# Altium schematic sheet ESC.SchDoc: ESCs
size B; Date: 03/24/2022; Author: Nathan Ayer; Organization: ORGANIZATION; Address1: ADDRESS 1; Address2: ADDRESS 2; Address3: ADDRESS 3; Address4: ADDRESS 4; DocumentNumber: 1; Revision: -; SheetNumber: 1; SheetTotal: 3; ENG_APP_DATE: --/--/--; DSN_APP_DATE: --/--/--; CHK_APP_DATE: --/--/--
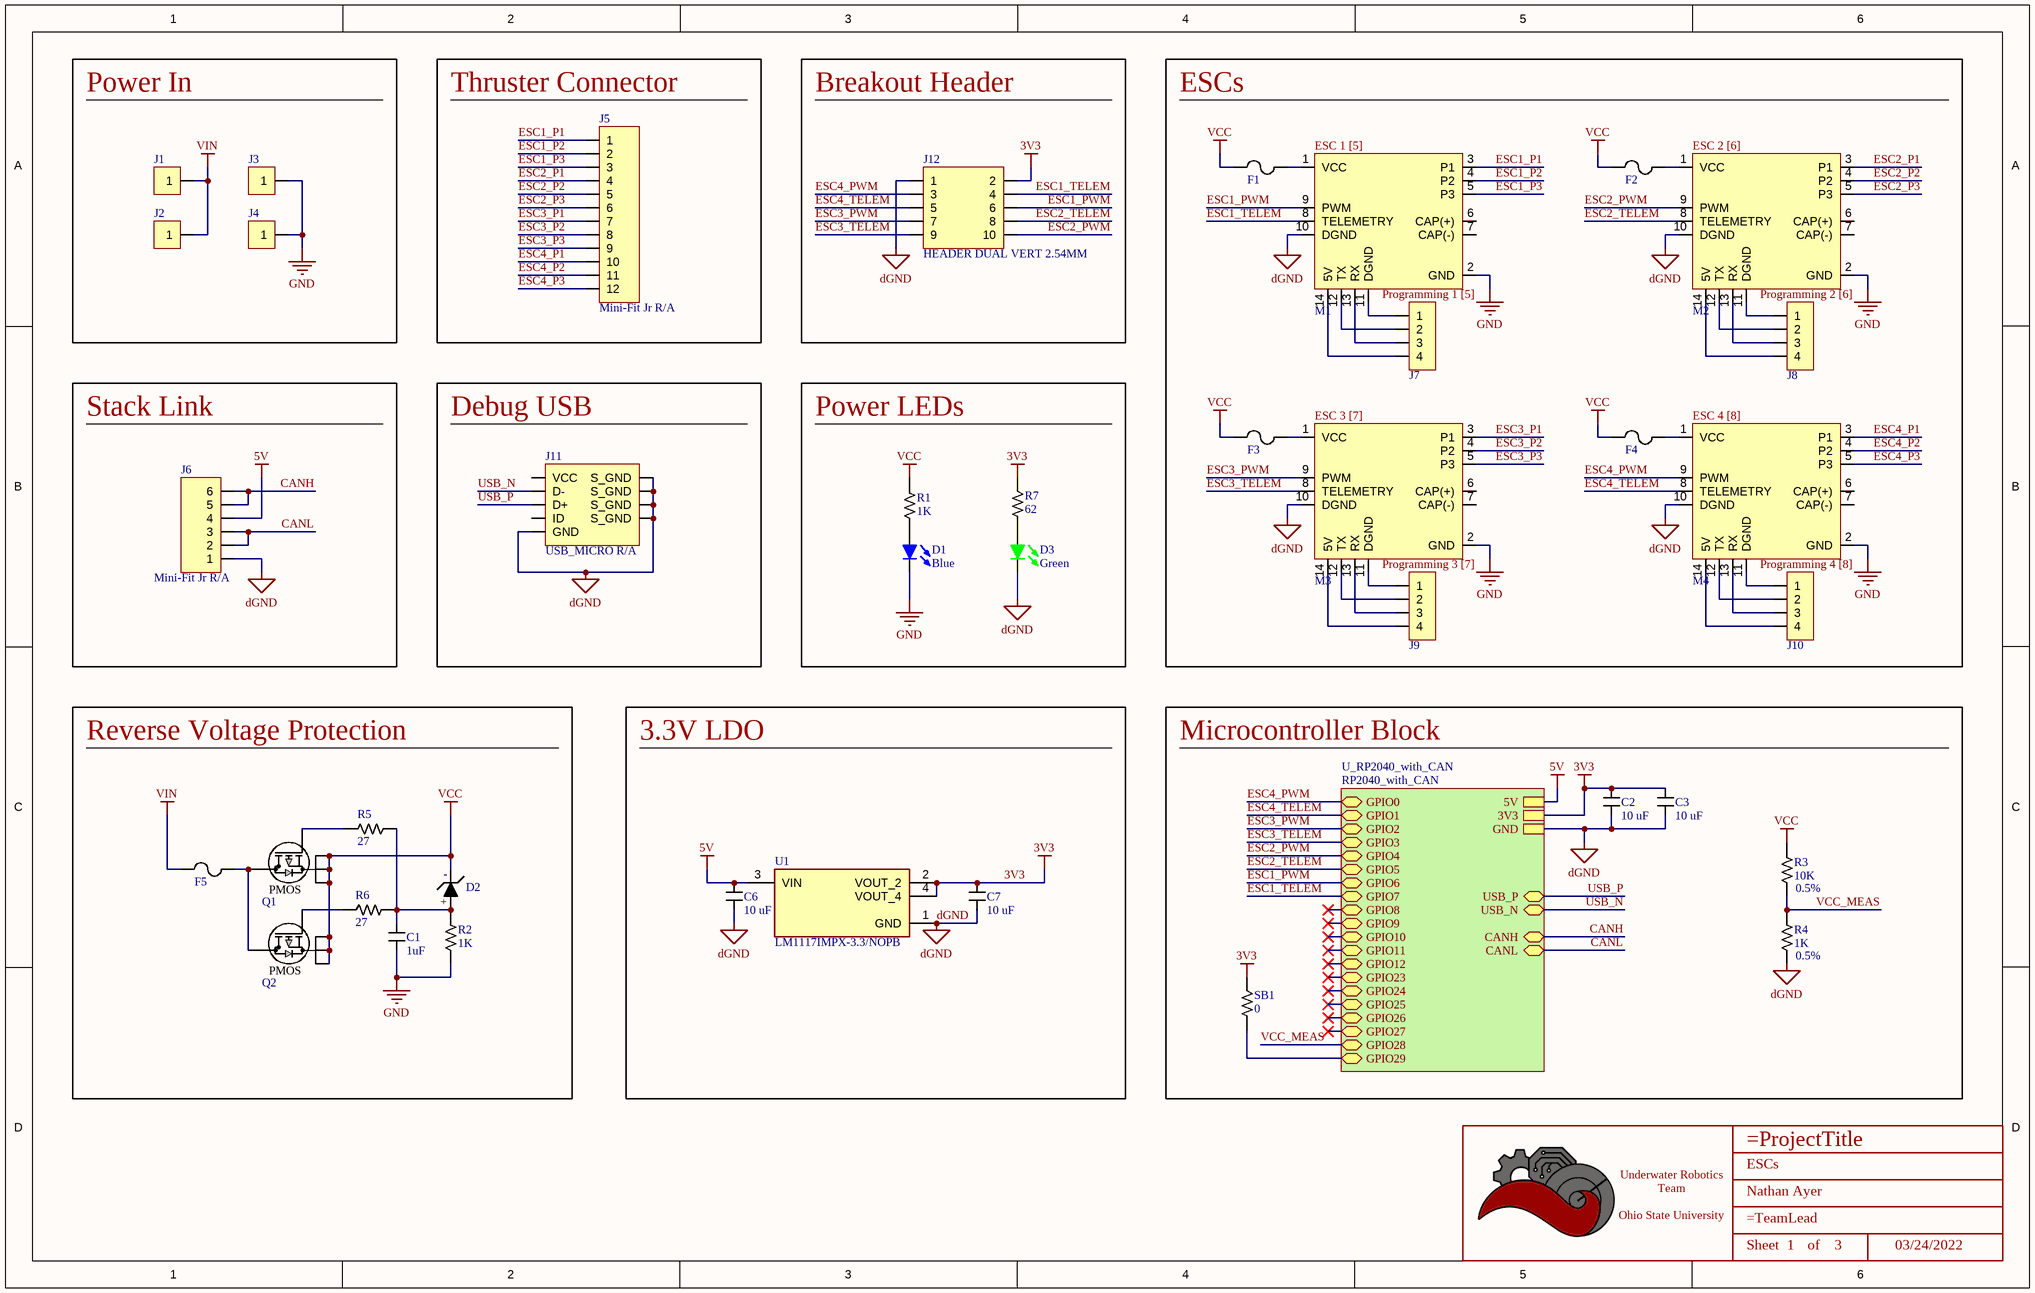
[diagram p0: ESC.SchDoc]

## Parts
*  Title_Block  [LOGO]  (value not drawn)  (graphical)
C1  value 1uF  [CAPACITOR_0603]  (hidden comment: 1uF Ceramic 16V)
C2  Value (uF): 10 uF  [CAPACITOR_0603]  (hidden comment: 10uF Ceramic 6.3V)
C3  Value (uF): 10 uF  [CAPACITOR_0603]  (hidden comment: 10uF Ceramic 6.3V)
C6  Value (uF): 10 uF  [CAPACITOR_0603]  (hidden comment: 10uF Ceramic 6.3V)
C7  Value (uF): 10 uF  [CAPACITOR_0603]  (hidden comment: 10uF Ceramic 6.3V)
D1  Color: Blue  [LED_0603]  (hidden comment: 150060BS75000)
D2  Zener_Diode_10V_410mW  [SOD-123]  (value not drawn)
D3  Color: Green  [LED_0603]  (hidden comment: 150060GS75000)
F1  0685H9150-01  [0501Series_LTF]  (value not drawn)
F2  0685H9150-01  [0501Series_LTF]  (value not drawn)
F3  0685H9150-01  [0501Series_LTF]  (value not drawn)
F4  0685H9150-01  [0501Series_LTF]  (value not drawn)
F5  1245HC60-RTR  [2-SMD Fuse]  (value not drawn)
J1  Redcube M4 Term 85A  [Redcube M4 Term 85A]  (value not drawn)
J2  Redcube M4 Term 85A  [Redcube M4 Term 85A]  (value not drawn)
J3  Redcube M4 Term 85A  [Redcube M4 Term 85A]  (value not drawn)
J4  Redcube M4 Term 85A  [Redcube M4 Term 85A]  (value not drawn)
J5  Mini-Fit Jr R/A  [CONN_MOLEX_MINIFIT JR_12 POS_R/A]
J6  Mini-Fit Jr R/A  [CONN_MOLEX_MINIFIT JR_6 POS_R/A]
J7  HEADER VERT 2.54MM  [HEADER_4PIN_2.54MM]  (value not drawn)
J8  HEADER VERT 2.54MM  [HEADER_4PIN_2.54MM]  (value not drawn)
J9  HEADER VERT 2.54MM  [HEADER_4PIN_2.54MM]  (value not drawn)
J10  HEADER VERT 2.54MM  [HEADER_4PIN_2.54MM]  (value not drawn)
J11  USB_MICRO R/A  [CONN_MINIUSB]
J12  HEADER DUAL VERT 2.54MM  [HEADER_2X5PIN_2.54MM]
M1  APD 80F3[X]  [APD 80F3[X]]  (value not drawn)
M2  APD 80F3[X]  [APD 80F3[X]]  (value not drawn)
M3  APD 80F3[X]  [APD 80F3[X]]  (value not drawn)
M4  APD 80F3[X]  [APD 80F3[X]]  (value not drawn)
Q1  MOSFET P-Ch 30V 60A SO-8  [MOSFET_7DP-T1-GE3_VIS]  (value not drawn)
Q2  MOSFET P-Ch 30V 60A SO-8  [MOSFET_7DP-T1-GE3_VIS]  (value not drawn)
R1  Value  (Ohms): 1K  [RESISTOR_0603]  (hidden comment: 1k Ohm 5% 1/8W)
R2  Value  (Ohms): 1K  [RESISTOR_0603]  (hidden comment: 1k Ohm 5% 1/8W)
R3  Value  (Ohms): 10K  [RESISTOR_0603]  (hidden comment: 10k Ohm 0.5% 1/10W)
R4  Value  (Ohms): 1K  [RESISTOR_0603]  (hidden comment: 1k Ohm 5% 1/10W)
R5  Value  (Ohms): 27  [RESISTOR_0603]  (hidden comment: 27 Ohm 5% 1/8W)
R6  Value  (Ohms): 27  [RESISTOR_0603]  (hidden comment: 27 Ohm 5% 1/8W)
R7  Value  (Ohms): 62  [RESISTOR_0603]  (hidden comment: 62 Ohm 1% 1/4W)
SB1  Value  (Ohms): 0  [RESISTOR_0603]  (hidden comment: 0 Ohm Jumper No Fit)
U1  LM1117IMPX-3.3/NOPB  [SOT-223-4]

## Blocks framed on the sheet
Power In: J1-J4
Thruster Connector: J5
Breakout Header: J12
ESCs: F1-F4 J7-J10 M1-M4
Stack Link: J6
Debug USB: J11
Power LEDs: D1 D3 R1 R7
Reverse Voltage Protection: C1 D2 F5 Q1 Q2 R2 R5 R6
3.3V LDO: C6 C7 U1
Microcontroller Block: C2 C3 R3 R4 SB1

## Sub-sheets
U_RP2040_with_CAN = RP2040_with_CAN: USB_P (bidir), USB_N (bidir), 5V, CANH (bidir), CANL (bidir), GPIO0 (bidir), GPIO1 (bidir), GPIO2 (bidir), GPIO3 (bidir), GPIO4 (bidir), GPIO5 (bidir), GPIO6 (bidir), GPIO7 (bidir), GPIO8 (bidir), GPIO9 (bidir), GPIO10 (bidir), GPIO11 (bidir), GPIO12 (bidir), GPIO23 (bidir), GPIO24 (bidir), GPIO25 (bidir), GPIO26 (bidir), GPIO27 (bidir), GPIO28 (bidir), GPIO29 (bidir), 3V3, GND

## Nets
3V3: C2.1 C3.1 C7.1 J12.2 R7.2 SB1.2 U1.2(VOUT_2) U1.4(VOUT_4) ; sheet U_RP2040_with_CAN/3V3
5V: C6.1 J6.4 U1.3(VIN) ; sheet U_RP2040_with_CAN/5V
dGND: C2.2 C3.2 C6.2 C7.2 D3.2 J6.1 J11.5(GND) J11.6(S_GND) J11.7(S_GND) J11.8(S_GND) J11.9(S_GND) J12.1 M1.10(DGND) M2.10(DGND) M3.10(DGND) M4.10(DGND) R4.2 U1.1(GND) ; sheet U_RP2040_with_CAN/GND
GND: C1.1 D1.2 J3.1 J4.1 M1.2(GND) M2.2(GND) M3.2(GND) M4.2(GND) R2.2
VCC: D2.2 F1.1 F2.1 F3.1 F4.1 Q1.1(S) Q1.2(S) Q1.3(S) Q2.1(S) Q2.2(S) Q2.3(S) R1.1 R3.1
VIN: F5.1 J1.1 J2.1
CANH: J6.5 J6.6 ; sheet U_RP2040_with_CAN/CANH
CANL: J6.2 J6.3 ; sheet U_RP2040_with_CAN/CANL
ESC1_P1: J5.1 M1.3(P1)
ESC1_P2: J5.2 M1.4(P2)
ESC1_P3: J5.3 M1.5(P3)
ESC1_PWM: J12.6 M1.9(PWM) ; sheet U_RP2040_with_CAN/GPIO6
ESC1_TELEM: J12.4 M1.8(TELEMETRY) ; sheet U_RP2040_with_CAN/GPIO7
ESC2_P1: J5.4 M2.3(P1)
ESC2_P2: J5.5 M2.4(P2)
ESC2_P3: J5.6 M2.5(P3)
ESC2_PWM: J12.10 M2.9(PWM) ; sheet U_RP2040_with_CAN/GPIO4
ESC2_TELEM: J12.8 M2.8(TELEMETRY) ; sheet U_RP2040_with_CAN/GPIO5
ESC3_P1: J5.7 M3.3(P1)
ESC3_P2: J5.8 M3.4(P2)
ESC3_P3: J5.9 M3.5(P3)
ESC3_PWM: J12.7 M3.9(PWM) ; sheet U_RP2040_with_CAN/GPIO2
ESC3_TELEM: J12.9 M3.8(TELEMETRY) ; sheet U_RP2040_with_CAN/GPIO3
ESC4_P1: J5.10 M4.3(P1)
ESC4_P2: J5.11 M4.4(P2)
ESC4_P3: J5.12 M4.5(P3)
ESC4_PWM: J12.3 M4.9(PWM) ; sheet U_RP2040_with_CAN/GPIO0
ESC4_TELEM: J12.5 M4.8(TELEMETRY) ; sheet U_RP2040_with_CAN/GPIO1
USB_N: J11.2(D-) ; sheet U_RP2040_with_CAN/USB_N
USB_P: J11.3(D+) ; sheet U_RP2040_with_CAN/USB_P
VCC_MEAS: R3.2 R4.1 ; sheet U_RP2040_with_CAN/GPIO28
NetC1_2: C1.2 D2.1 R2.1 R5.2 R6.1
NetD1_1: D1.1 R1.2
NetD3_1: D3.1 R7.1
NetF1_2: F1.2 M1.1(VCC)
NetF2_2: F2.2 M2.1(VCC)
NetF3_2: F3.2 M3.1(VCC)
NetF4_2: F4.2 M4.1(VCC)
NetF5_2: F5.2 Q1.D Q2.D
NetJ7_1: J7.1 M1.11(DGND)
NetJ7_2: J7.2 M1.12(TX)
NetJ7_3: J7.3 M1.13(RX)
NetJ7_4: J7.4 M1.14(5V)
NetJ8_1: J8.1 M2.11(DGND)
NetJ8_2: J8.2 M2.12(TX)
NetJ8_3: J8.3 M2.13(RX)
NetJ8_4: J8.4 M2.14(5V)
NetJ9_1: J9.1 M3.11(DGND)
NetJ9_2: J9.2 M3.12(TX)
NetJ9_3: J9.3 M3.13(RX)
NetJ9_4: J9.4 M3.14(5V)
NetJ10_1: J10.1 M4.11(DGND)
NetJ10_2: J10.2 M4.12(TX)
NetJ10_3: J10.3 M4.13(RX)
NetJ10_4: J10.4 M4.14(5V)
NetQ1_4: Q1.4(G) R5.1
NetQ2_4: Q2.4(G) R6.2
NetSB1_1: SB1.1 ; sheet U_RP2040_with_CAN/GPIO29

Not connected (* = marked no-connect by the designer): J11 1(VCC) 4(ID); M1 6(CAP(+)) 7(CAP(-)); M2 6(CAP(+)) 7(CAP(-)); M3 6(CAP(+)) 7(CAP(-)); M4 6(CAP(+)) 7(CAP(-))

## Notes on the sheet
- (near M1) ESC 1 [5]
- (near M2) ESC 2 [6]
- (near M1) Programming 1 [5]
- (near M2) Programming 2 [6]
- (near M3) ESC 3 [7]
- (near M4) ESC 4 [8]
- (near M3) Programming 3 [7]
- (near M4) Programming 4 [8]
- (near R3) 0.5%
- (near R4) 0.5%
- DWG. NO.
- REV.
- SHT.
- THIS DOCUMENT AND THE DATA DISCLOSED HEREIN OR HEREWITH IS THE PROPERTY OF ALTIUM LIMITED AND MAY BE FREELY DISTRIBUTED IN WHOLE. NO RIGHTS ARE RESERVED OR EXPRESS OR IMPLIED WARANTEE GIVEN.
- REVISION
- DESCRIPTION
- DATE
- APPROVED
- ENG:
- APPROVALS
- PROJECT
- DSN:
- CHK:
- REFERENCE DOCUMENTS
- PROJECT REVISION:
- TITLE
- DOCUMENT REVISION:
- DESIGN ITEM:
- BOM:
- FAB DWG:
- PCB DWG:
- ASSY DWG:
- SCALE:
- SIZE
- B
- CAGE CODE
- FILE NAME
- DWG NO.
- SHEET
- OF
- REV
- (in symbol SIR167DP-T1-GE3) PMOS
- (in symbol Title_Block) Underwater Robotics Team / Ohio State University; Sheet; of
- (in symbol Zener_Diode_10V_410mW) -; +

## Library data of the parts
* = Title_Block: UWRT Schematic Title Block Template / Created June 2021, Dylan Trainor
C1 = CAPACITOR_1uF_0603: Cap 1uF 16V +/-10% / Ceramic 0603; Made By: Flip B; Tolerance: +/- 10%; Voltage: 16V; Supplier 1: Digi-Key; Supplier Part Number 1: 399-7847-1-ND
C2 C3 C6 C7 = CAPACITOR_10uF_0603: Cap 10uF 6.3V +/-20% / Ceramic 0603; Made By: Flip B; ComponentLink1Description: Digikey; ComponentLink1URL: https://www.digikey.com/en/products/detail/samsung-electro-mechanics/CL10A106MQ8NNNC/3886777; Supplier 1: Digi-Key; Supplier Part Number 1: 1276-1119-1-ND; Tolerance: +/- 20%; Voltage: 6.3V
D1 = LED_Blue_0603: LED Blue Vf= 3.2V If = 0.020A / 150060BS75000; Made By: Robert Pafford; Forward Current: 20mA; Forward Voltage: 3.2V; Package: 0603; Supplier 1: Digi-Key; Supplier Part Number 1: 732-4966-1-ND
D2 = Zener_Diode_10V_410mW: Zener Diode | 10 V | 410 mW | SOD 123; Made By: Nathan A; Voltage - Zener: 10V; Power: 410mW; Package: SOD-123; Supplier 1: Digi-Key; Supplier Part Number 1: 3757-BZT52-C10_R1_00001CT-ND; ComponentLink1Description: Datasheet; ComponentLink1URL: https://www.panjit.com.tw/upload/datasheet/BZT52-C2V4_SERIES.pdf
D3 = LED_Green_0603_3.2V: LED Green Vf= 3.2V If = 0.025A / 150060GS75000; Made By: Flip B; Forward Current: 25mA; Supplier 1: Digi-Key; ComponentLink1Description: Datasheet; ComponentLink1URL: https://www.we-online.de/katalog/datasheet/150060GS75000.pdf; Supplier Part Number 1: 732-4971-1-ND; Forward Voltage: 3.2V; Package: 0603
F1-F4 = Bel Fuse 15A: Bel Fuse  | 15A | 32V DC | SMD | Fast Blow | 1206; Current Rating: 15; Breaking Capacity: 150A; Mfr_Name: Bel Fuse; Manufacturer_Part_Number: 0685H9150-01; Voltage Rating: 32V; Response Time: Fast Blow; Package: 1206; Created By: Nathan Ayer
F5 = Eaton 60A Fuse: Eaton  | 60A | 80V DC | SMD | Fast Blow | 2-SMD; Breaking Capacity: 1kA; Mfr_Name: Eaton; Manufacturer_Part_Number: 1245HC60-RTR; Current Rating: 60A; Voltage Rating: 80V; Response Time: Fast Blow; Package: 2-SMD; Created By: Nathan Ayer; ComponentLink1Description: DigiKey; ComponentLink1URL: https://www.digikey.com/en/products/detail/eaton-electronics-division/1245HC60-RTR/13913536
J5 = CONN_MOLEX_MINIFIT JR_12POS_R/A: Molex Minifit Jr. 5569 / 12 Pos R/A Natural; Pitch: 4.2mm; Configuration: Right Angle; Current Per Pin: 13A; Number of Positions: 12; Manufacturer: Molex; Color: Natural; Created By: Flip B; ComponentLink1Description: Datasheet; ComponentLink1URL: https://www.molex.com/pdm_docs/ps/PS-5556-001.pdf; Series: Minifit Jr 5569; Supplier 1: Digi-Key; Supplier Part Number 1: WM21356-ND
J6 = CONN_MOLEX_MINIFIT JR_6POS_R/A: Molex Minifit Jr. 5569 / 6 Pos R/A Natural; Pitch: 4.2mm; Configuration: Right Angle; Current Per Pin: 13A; Number of Positions: 8; Manufacturer: Molex; Color: Natural; Created By: Flip B; ComponentLink1Description: Datasheet; ComponentLink1URL: https://www.molex.com/pdm_docs/ps/PS-5556-001.pdf; Series: Minifit Jr 5569; Supplier 1: Digi-Key; Supplier Part Number 1: WM1353-ND
J7-J10 = HEADER_4PIN_2.54MM: CONN HEADER VERT 4POS 2.54MM; Made By: Robert Pafford; Supplier 1: Digi-Key; Supplier Part Number 1: S1012E-04-ND
J11 = CONN_MICROUSB: Amphenol Micro USB-B / USB2.0 5 Pin Right Angle SMD; Pitch: 0.65mm; Current Per Pin: 1.8A; Number of Positions: 5; Manufacturer: Amphenol; Configuration: Right Angle; Color: Silver; Created By: Flip B; ComponentLink1Description: Datasheet; ComponentLink1URL: https://cdn.amphenol-icc.com/media/wysiwyg/files/documentation/datasheet/inputoutput/io_usb_micro.pdf?__cf_chl_jschl_tk__=05693735e19256298f6ef6ca2bb2e65c376a4f56-1625503833-0-Abitsb0-ufjOXJYs_S3J3r2iTn-nObalbmXUksF1VvO_h_WEmRdMlUD1I8-hmWSEVWzY1pirKnrPZWfgY3851qyBZe5ZvnNQePLGIzUgdEIQBVUyW36RsbYpDLEWxJ4horD-5gChFgobLYqwmG5aHl0E8lIn_twwPPrOxilK2gP0q9t_CNOs_u5fMqXvXUrlsOv8tIE2NRlu6NVP8qtkL2GjhlkeTUbDMF8WvvpPDTFOgvZ4Y16Ej8F8AhWos88mo5B1HssXozw0XrkJQIqERITUu6rqloz9kf4ZzhBHtDAt-IkiAFY_Ds9SW8FYKKTtINJVpHZQ6Gyu1FFM4Dc9MO0maE8_mmNcwlxqyRoRk_MPWW8VyByXWM5RSp52jteRKw7FeI9WIYvCbPAOy0Eyib-aseIQsnGbglBcUY6_2xp8GYaJM38H3dNvBPsSOfJBPndKedwKHllxjkucXn6xsN0sDXkpGN-cu8_2bDTJ0g-uUucKSCooYX-ApSDNGpkA_p9zv1SOAD8c0zaZVmtiBsN75QpVz2rzq9_BFxOywPvR; Series: 10118192; Supplier 1: Digi-Key; Supplier Part Number 1: 609-4613-1-ND
J12 = HEADER_2x5PIN_2.54MM: CONN HEADER VERT 10POS 2.54MM; Made By: Robert Pafford; Supplier 1: Digi-Key; Supplier Part Number 1: 732-2672-ND
M1-M4 = APD 80F3[X]: Advanced Power Drives 80F3[X] ESC | 15-35V | 80A; Max Current: 80A Continuous; ComponentLink1Description: General Info; ComponentLink1URL: https://powerdrives.net/80f3; ComponentLink2Description: Data Sheet; ComponentLink2URL: https://docs.powerdrives.net/products/f-series-esc/overview; Created By: Nathan Ayer; Voltage: 15-35V; Manufacturer: Advanced Power Drives
Q1 Q2 = SIR167DP-T1-GE3: P-Channel 30 V 60A (Tc) 65.8W (Tc) Surface Mount PowerPAK® SO-8; Mfr_Name: Vishay; Type: DEV; Copyright: Copyright (C) 2022 Ultra Librarian. All rights reserved.; Manufacturer_Part_Number: SIR167DP-T1-GE3; RefDes: RefDes
R1 R2 = RESISTOR_1K_0603: RES 1k OHM 5% 1/8W 0603; Tolerance: +/- 5%; Made By: Robert Pafford; ComponentLink1Description: Datasheet; ComponentLink1URL: https://www.bourns.com/docs/product-datasheets/CRxxxxx.pdf; Wattage: 1/8W; Supplier: Digikey; Digikey Part Numer: CR0603-JW-104ELFTR-ND; Supplier 1: Digi-Key; Supplier Part Number 1: 2019-RK73B1JTTD102JCT-ND
R3 = RESISTOR_10K_0.5%_0603: RES 10k OHM 0.5% 1/10W 0603; Tolerance: +/- 0.5%; Made By: Robert Pafford; Wattage: 1/10W; Supplier: Digikey; Digikey Part Numer: CR0603-JW-104ELFTR-ND; Supplier 1: Digi-Key; Supplier Part Number 1: 749-1695-1-ND
R4 = RESISTOR_1K_0.5%_0603: RES 1k OHM 0.5% 1/10W 0603; Tolerance: +/- 0.5%; Made By: Robert Pafford; Wattage: 1/10W; Supplier: Digikey; Digikey Part Numer: CR0603-JW-104ELFTR-ND; Supplier 1: Digi-Key; Supplier Part Number 1: 749-1693-1-ND
R5 R6 = RESISTOR_27_0603: RES 27 OHM 5% 1/8W 0603; Tolerance: +/- 5%; Made By: Robert Pafford; ComponentLink1Description: Datasheet; ComponentLink1URL: https://www.bourns.com/docs/product-datasheets/CRxxxxx.pdf; Wattage: 1/8W; Supplier: Digikey; Digikey Part Numer: CR0603-JW-104ELFTR-ND; Supplier 1: Digi-Key; Supplier Part Number 1: 2019-RK73B1JTTD270JCT-ND
R7 = RESISTOR_62_0603: RES SMD 62 OHM 1% 1/4W 0603; Tolerance: +/- 1%; Made By: Robert Pafford; ComponentLink1Description: Datasheet; ComponentLink1URL: https://www.bourns.com/docs/product-datasheets/CRxxxxx.pdf; Wattage: 1/4W; Supplier: Digikey; Digikey Part Numer: CR0603-JW-104ELFTR-ND; Supplier 1: Digi-Key; Supplier Part Number 1: 541-RCS060362R0FKEACT-ND
SB1 = JUMPER_0_0603: 0 Ohm Jumper No Fit for Solder Bridge; Made By: Robert Pafford; ComponentLink1Description: Digikey; ComponentLink1URL: https://www.digikey.com/en/products/detail/koa-speer-electronics-inc/RK73B1JTTD101J/9844701
U1 = LM1117IMPX-3.3/NOPB: 800-mA 15-V linear voltage regulator 4-SOT-223 -40 to 125; MF: Texas Instruments; Texas_Instruments-Purchase-URL: https://snapeda.com/shop?store=Texas+Instruments&id=410186; Price: None; Mouser-Purchase-URL: https://snapeda.com/shop?store=Mouser&id=410186; MP: LM1117IMPX-3.3/NOPB; Value: *; Availability: Good; Package: SOT-223-4 Texas Instruments; Arrow_Electronics-Purchase-URL: https://snapeda.com/shop?store=Arrow+Electronics&id=410186; SnapEDA_Link: https://www.snapeda.com/parts/LM1117IMPX-3.3/NOPB/Texas%20Instruments/view-part/410186/?ref=snap; DigiKey-Purchase-URL: https://snapeda.com/shop?store=DigiKey&id=410186
J1-J4 = Redcube M4 Term 85A: Created By: Nahtan Ayer; Current Rating: 85 A; Screw Size: M4